# EAGLE design bristol_longshot (EAGLE 7.3.0)
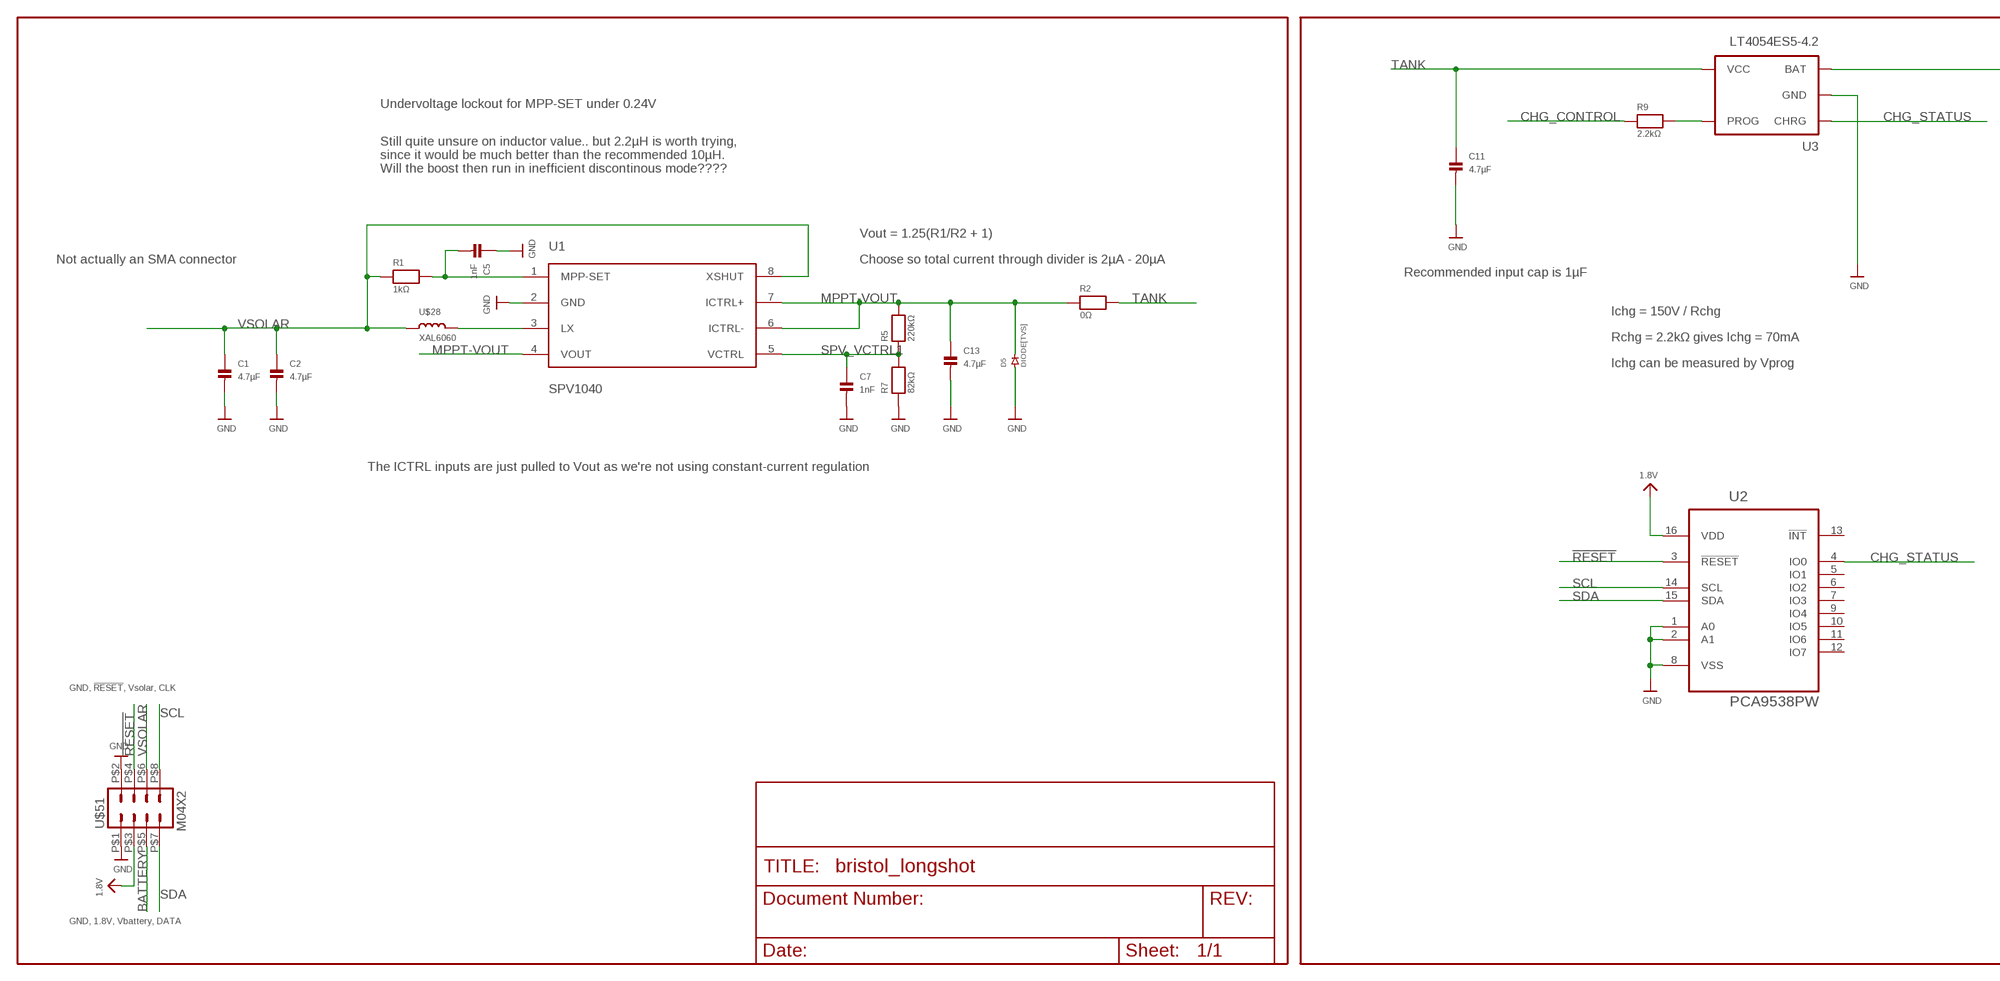
[diagram p0: schematic, sheet 1, part 1 of 2]
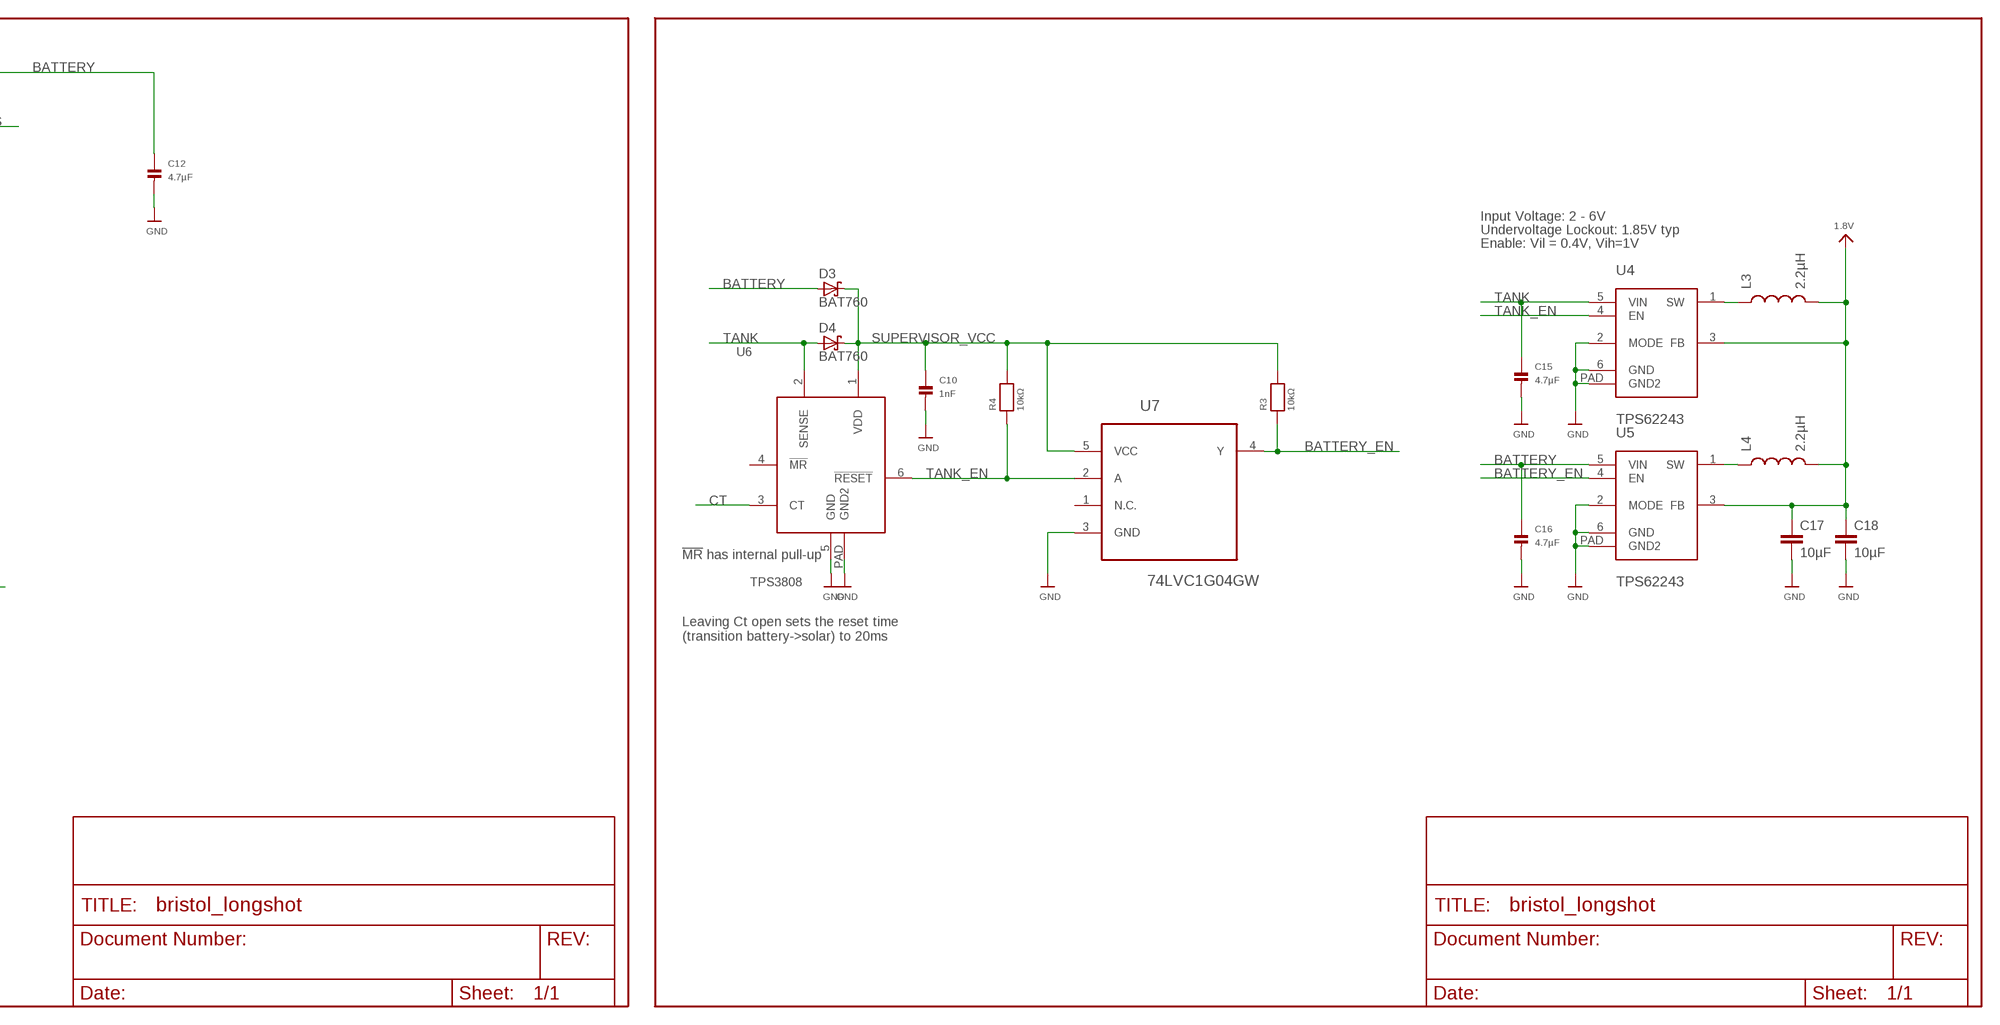
[diagram p1: schematic, sheet 1, part 2 of 2]

## Parts
C1  4.7µF  CAP_CERAMIC_0402  [_0402]
C2  4.7µF  CAP_CERAMIC_0402  [_0402]
C5  1nF  CAP_CERAMIC_0402  [_0402]
C7  1nF  CAP_CERAMIC_0402  [_0402]
C10  1nF  CAP_CERAMIC_0402  [_0402]
C11  4.7µF  CAP_CERAMIC_0402  [_0402]
C12  4.7µF  CAP_CERAMIC_0402  [_0402]
C13  4.7µF  CAP_CERAMIC_0402  [_0402]
C15  4.7µF  CAP_CERAMIC_0402  [_0402]
C16  4.7µF  CAP_CERAMIC_0402  [_0402]
C17  10µF  C-EUC0603K  [C0603K]
C18  10µF  C-EUC0603K  [C0603K]
D3  BAT760  [SOD323]
D4  BAT760  [SOD323]
D5  DIODE[TVS]  [SOD123W]
L3  2.2µH  INDUCTOR1007  [1007]
L4  2.2µH  INDUCTOR1007  [1007]
R1  1kΩ  RESISTOR_0402  [_0402]
R2  0Ω  RESISTOR_0402  [_0402]
R3  10kΩ  RESISTOR_0402  [_0402]
R4  10kΩ  RESISTOR_0402  [_0402]
R5  220kΩ  RESISTOR_0402  [_0402]
R7  82kΩ  RESISTOR_0402  [_0402]
R9  2.2kΩ  RESISTOR_0402  [_0402]
U1  SPV1040  [TSSOP8]
U2  PCA9538PW  [SOP65P640X110-16N]
U3  LT4054ES5-4.2  [SOT23-5]
U4  TPS62243  [S-PWSON-N6]
U5  TPS62243  [S-PWSON-N6]
U6  TPS3808  [S-PWSON-N6]
U7  74LVC1G04GW  [SOT65P210X110-5N]
U$28  XAL6060  [XAL60]
U$51  M04X2  [M04X2]

## Nets
1.8V: C17.1 C18.1 L3.2 L4.2 U2.16(VDD) U4.3(FB) U5.3(FB) U$51.P$3
!RESET: U2.3(!RESET) U$51.P$4
BATTERY: C12.1 C16.1 D3.A U3.3(BAT) U5.5(VIN) U$51.P$5
BATTERY_BUCK_SW: L4.1 U5.1(SW)
BATTERY_EN: R3.1 U5.4(EN) U7.4(Y)
CHG_CONTROL: R9.1
CHG_STATUS: U2.4(IO0) U3.1(CHRG)
CT: U6.3(CT)
GND: C1.2 C2.2 C5.1 C7.2 C10.2 C11.2 C12.2 C13.2 C15.2 C16.2 C17.2 C18.2 D5.P$1 R7.1 U1.2(GND) U2.1(A0) U2.2(A1) U2.8(VSS) U3.2(GND) U4.2(MODE) U4.6(GND) U4.PAD(GND2) U5.2(MODE) U5.6(GND) U5.PAD(GND2) U6.5(GND) U6.PAD(GND2) U7.3(GND) U$51.P$1 U$51.P$2
LX1: U1.3(LX) U$28.P$2
MPP-SET: C5.2 R1.2 U1.1(MPP-SET)
MPPT-VOUT: C13.1 D5.P$2 R2.1 R5.2 U1.4(VOUT) U1.6(ICTRL-) U1.7(ICTRL+)
PROG: R9.2 U3.5(PROG)
SCL: U2.14(SCL) U$51.P$8
SDA: U2.15(SDA) U$51.P$7
SPV_VCTRL1: C7.1 R5.1 R7.2 U1.5(VCTRL)
SUPERVISOR_VCC: C10.1 D3.C D4.C R3.2 R4.2 U6.1(VDD) U7.5(VCC)
TANK: C11.1 C15.1 D4.A R2.2 U3.4(VCC) U4.5(VIN) U6.2(SENSE)
TANK_BUCK_SW: L3.1 U4.1(SW)
TANK_EN: R4.1 U4.4(EN) U6.6(!RESET) U7.2(A)
VSOLAR: C1.1 C2.1 R1.1 U1.8(XSHUT) U$28.P$1 U$51.P$6
Unconnected: U2.5(IO1) U2.6(IO2) U2.7(IO3) U2.9(IO4) U2.10(IO5) U2.11(IO6) U2.12(IO7) U2.13(!INT) U6.4(!MR) U7.1(N.C.)

## Notes on the sheet
- Undervoltage lockout for MPP-SET under 0.24V
- Still quite unsure on inductor value.. but 2.2µH is worth trying,
  since it would be much better than the recommended 10µH.
  Will the boost then run in inefficient discontinous mode????
- Input Voltage: 2 - 6V
- Undervoltage Lockout: 1.85V typ
- Vout = 1.25(R1/R2 + 1) | Enable: Vil = 0.4V, Vih=1V
- Not actually an SMA connector | Choose so total current through divider is 2µA - 20µA
- Recommended input cap is 1µF
- Ichg = 150V / Rchg
- Rchg = 2.2kΩ gives Ichg = 70mA
- Ichg can be measured by Vprog
- The ICTRL inputs are just pulled to Vout as we're not using constant-current regulation
- !MR! has internal pull-up
- Leaving Ct open sets the reset time
  (transition battery->solar) to 20ms
- GND, !RESET!, Vsolar, CLK
- GND, 1.8V, Vbattery, DATA

## Library data of the parts
C1 C2 C5 C7 C10-C13 C15 C16 = microbuilder_v3:CAP_CERAMIC: Ceramic Capacitors 0402 - 0402 Surface Mount Capacitors 16pF 50V 5% [Digikey: 445-4899-2-ND] 18pF 50V 5% [Digikey: 490-1281-2-ND] 22pF 50V 5% [Digikey: 490-1283-2-ND] 68pF 50V 5% [Digikey: 490-1289-2-ND] 0.1uF 10V 10% [Digikey: 490-1318-2-ND] 1.0uF 6.3V 10% [Digikey: 490-1320-2-ND] 0603 - 0603 Surface Mount Capacitors 16 pF 50V 5% [Digikey: 445-5051-2-ND] 22 pF 50V [Digikey: PCC220ACVTR-ND] 33 pF 50V 5% [Digikey: 490-1415-1-ND] 56pF 50V 5% [Digikey: 490-1421-1-ND] 220pF 50V 5% [Digikey: 445-1285-1-ND] 680 pF 50V 2200 pF 50V 5% C0G [Digikey: 445-1297-1-ND] 5600 pF 100V 5% X7R [Digikey: 478-3711-1-ND] 0.1 µF 25V 10% [Digikey: PCC2277TR-ND] 0.22 µF 16V 10% X7R [Digikey: 445-1318-1-ND] 1.0 µF 25V 10% [Digikey: 445-5146-2-ND] 0603 - RF Specific 3pF 250V +/-0.1pF RF [Digikey: 712-1347-1-ND] 18 pF 250V 5% [Digikey: 478-3505-1-ND or 712-1322-1-ND] 56 pF 250V 5% C0G RF [Digikey: 490-4867-1-ND] 68 pF 250V RF [Digikey: 490-4868-1-ND] 0805 - 0805 Surface Mount Capacitors 220 pF 250V 2% RF Ceramic Capacitor [Digikey: 712-1398-1-ND] 1000 pF 50V 2% NP0 Ceramic Capacitor [Digikey: 478-3760-1-ND] 0.1 µF 25V 10% Ceramic Capacitor [Digikey: PCC1828TR-ND] 1.0 µF 16V 10% Ceramic Capacitor[Digikey: 490-1691-2-ND] 10.0 µF 10V 10% Ceramic Capacitor[Digikey: 709-1228-1-ND] 10.0 uF 16V 10% Ceramic Capacitor [Digikey: 478-5165-2-ND] 47 uF 6.3V 20% Ceramic Capacitor [Digikey: 587-1779-1-ND or 399-5506-1-ND] 1206 - 1206 Surface Mount Capacitors 47uF 10V 20% Ceramic Capacitor [Digikey: 490-5528-1-ND or 399-5508-1-ND or 445-6010-1-ND] 100uF 6.3V -20%, +80% Y5V Ceramic Capacitor (Digikey: 490-4512-1-ND, Mouser: 81-GRM31CF50J107ZE1L)
C17 C18 = resistor:C-EU: CAPACITOR, European symbol
D3 D4 = BAT760:BAT760
D5 = nxp:DIODE[TVS]
L3 L4 = SparkFun:INDUCTOR: Inductors Basic Inductor/Choke - 0603 and 1206. Footprints are not proven and vary greatly between part numbers.
R1-R5 R7 R9 = microbuilder_v3:RESISTOR: Resistors 0402 - 0402 Surface Mount Package 22 Ohm 1% 1/16W [Digikey: 311-22.0LRTR-ND] 33 Ohm 5% 1/16W 1.0K 5% 1/16W 1.5K 5% 1/16W 2.0K 1% 1/16W 10.0K 1% 1/16W [Digikey: 311-10.0KLRTR-ND] 10.0K 5% 1/16W [Digikey: RMCF0402JT10K0TR-ND] 12.1K 1% 1/16W [Digikey: 311-22.0LRTR-ND] 100.0K 5% 1/16W 0603 - 0603 Surface Mount Package 0 Ohm 1/10 Watt 1% Resistor 15 Ohm 1/10 Watt 1% Resistor 33 Ohm 1/10 Watt 1% Resistor 49.9 Ohm 1/10 Watt 1% Resistor 100 Ohm 1/10 Watt 1% Resistor 150 Ohm 1/10 Watt 1% Resistor 240 Ohm 1/10 Watt 1% Resistor 390 Ohm 1/10 Watt 1% Resistor 560 Ohm 1/10 Watt 1% Resistor 680 Ohm 1/10 Watt 1% Resistor 750 Ohm 1/10 Watt 1% Resistor 1.0K Ohm 1/10 Watt 1% Resistor 1.5K Ohm 1/10 Watt 1% Resistor 2.0K Ohm 1/10 Watt 1% Resistor 2.2K Ohm 1/10 Watt 1% Resistor 3.3K Ohm 1/10 Watt 1% Resistor 4.7K Ohm 1/10 Watt 1% Resistor 10.0K Ohm 1/10 Watt 1% Resistor 12.0K Ohm 1/10 Watt 1% Resistor 12.1K Ohm 1/10 Watt 1% Resistor 20.0K Ohm 1/10 Watt 1% Resistor 33.0K Ohm 1/10 Watt 1% Resistor 100.0K Ohm 1/10 Watt 1% Resistor 0805 - 0805 Surface Mount Package 0 Ohm 1/8 Watt 1% Resistor 33 Ohm 1/8 Watt 1% Resistor 100 Ohm 1/8 Watt 1% Resistor 150 Ohm 1/8 Watt 1% Resistor 200 Ohm 1/8 Watt 1% Resistor 240 Ohm 1/8 Watt 1% Resistor 330 Ohm 1/8 Watt 1% Resistor 390 Ohm 1/8 Watt 1% Resistor 470 Ohm 1/8 Watt 1% Resistor 1.0K Ohm 1/8 Watt 1% Resistor 1.5K Ohm 1/8 Watt 1% Resistor 2.0K Ohm 1/8 Watt 1% Resistor 4.7K Ohm 1/8 Watt 1% Resistor 5.1K Ohm 1/8 Watt 1% Resistor 5.6K Ohm 1/8 Watt 1% Resistor 10.0K Ohm 1/8 Watt 1% Resistor 22.0K Ohm 1/8 Watt 1% Resistor 33.0K Ohm 1/8 Watt 1% Resistor 100K Ohm 1/8 Watt 1% Resistor 1206 - 1206 Surface Mount Package 2012 - 2010 Surface Mount Package 0.11 Ohm 1/2 Watt 1% Resistor - Digikey: RHM.11UCT-ND
U1 = spv1040:SPV1040
U2 = PCA9538PW:PCA9538PW: IC, IO PORT, I2C/SMBUS 8BIT, 16TSSOP; MPN: PCA9538PW; OC_FARNELL: 2212095; OC_NEWARK: 55W4315; PACKAGE: TSSOP16; SUPPLIER: NXP
U3 = XYKlib:LT4054: Standalone Linear Li-Ion Battery Charger A complete constant-current/constant voltage linear charger for single cell lithium-ion batteries.in SOT-23-5 package.
U4 U5 = TPS62243:TPS62243
U6 = TPS3808:TPS3808
U7 = 74LVC1G04GW_inverter:74LVC1G04GW: Single inverter; MPN: 74LVC1G04GW; OC_FARNELL: 1631683; OC_NEWARK: 03P2774; PACKAGE: SOT-5; SUPPLIER: NXP
U$28 = XAL6060:XAL6060
U$51 = fbri:M04X2

## Board
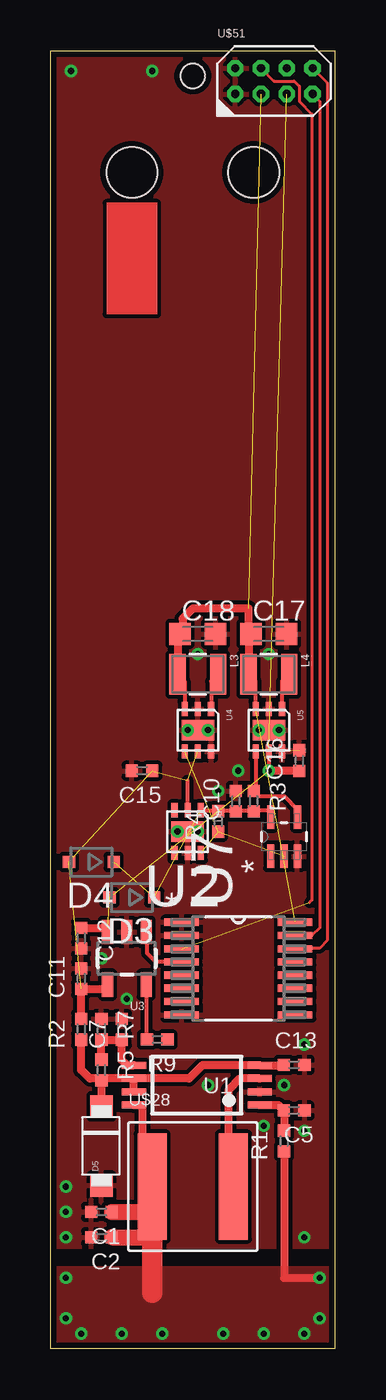
[diagram p2: board, top side]
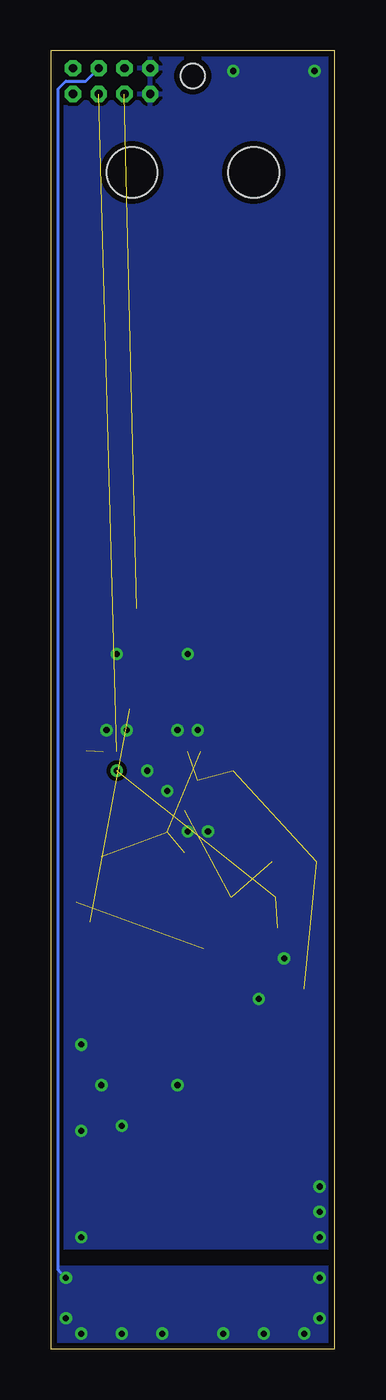
[diagram p3: board, bottom side, seen from below]

Size 14 x 64 mm. Coordinates in mm from the lower left corner, seen from the top.
Outline: 0,0 0,64 14,64 14,0 0,0
Copper layers (1*16): Top 0.035mm / dielectric 1.5mm / Bottom 0.035mm
Design rules "PCB-POOL Standard *": minimum track width 0.15mm, minimum drill 0.3mm, track to track 0.15mm, track to pad 0.15mm, pad to pad 0.15mm, via to via 0.15mm, smd to smd 0.15mm, copper to edge 0.3mm, drill to drill 0.2mm, minimum pad ring 0.2mm, minimum via ring 0.15mm, stop-mask expansion 0.075mm, vias tented up to drill 0.3mm, thermal gap 0.2mm
Holes 1.2 mm at 7,62.75
Holes 2.5 mm at 4,58 10,58

### Footprints (pad centres in the part's own frame; a part is rotated, then mirrored left to right if it is on the bottom)
_0402 = smd 0.6 x 0.6: 1 -0.508,0; 2 0.508,0
C0603K = smd 1.05 x 1.08: 1 -0.875,0; 2 0.875,0
SOD323 = smd 0.6 x 0.6: A 1.1,0; C -1.1,0
SOD123W = smd 1.1 x 1.1: P$1 -1.95,0; P$2 1.95,0
1007 = smd 2 x 0.8: 1 0,1; 2 0,-1
TSSOP8 = smd 1.2 x 0.35: 1 -0.8,0.475; 2 -0.8,-0.175; 3 -0.8,-0.825; 4 -0.8,-1.475; 5 5.4,-1.475; 6 5.4,-0.825; 7 5.4,-0.175; 8 5.4,0.475
SOP65P640X110-16N = smd 1.702 x 0.356: 1 -2.794,2.286; 2 -2.794,1.626; 3 -2.794,0.965; 4 -2.794,0.33; 5 -2.794,-0.33; 6 -2.794,-0.965; 7 -2.794,-1.626; 8 -2.794,-2.286; 9 2.794,-2.286; 10 2.794,-1.626; 11 2.794,-0.965; 12 2.794,-0.33; 13 2.794,0.33; 14 2.794,0.965; 15 2.794,1.626; 16 2.794,2.286
SOT23-5 = smd 0.55 x 1.2: 1 -0.95,-1.3; 2 0,-1.3; 3 0.95,-1.3; 4 0.95,1.3; 5 -0.95,1.3
S-PWSON-N6 = smd 0.3 x 0.7: 1 -0.65,-1.05; 2 0,-1.05; 3 0.65,-1.05; 4 0.65,1.05; 5 0,1.05; 6 -0.65,1.05 | smd 1.6 x 1: PAD 0,0
SOT65P210X110-5N = smd 1.168 x 0.356: 1 -0.965,0.66; 2 -0.965,0; 3 -0.965,-0.66; 4 0.965,-0.66; 5 0.965,0.66
XAL60 = smd 1.43 x 5.24: P$1 -2,0; P$2 2,0
M04X2 = drill 0.4 octagon: P$1 -1.905,-0.635; P$2 -1.905,0.635; P$3 -0.635,-0.635; P$4 -0.635,0.635; P$5 0.635,-0.635; P$6 0.635,0.635; P$7 1.905,-0.635; P$8 1.905,0.635

### Placement (x,y rotation side)
C1  2.5,6.75 180 top
C2  2.5,5.5 180 top
C5  12,11.75 180 top
C7  3.5,15.75 90 top
C10  9.12,27 90 top
C11  1.5,18.25 90 top
C12  1.5,20.25 270 top
C13  12,14 0 top
C15  4.5,28.5 180 top
C16  12.25,29 90 top
C17  10.75,35.25 0 top
C18  7.25,35.25 0 top
D3  4,22.25 180 top
D4  2,24 180 top
D5  2.5,10 90 top
L3  7.25,33.25 270 top
L4  10.75,33.25 270 top
R1  11.5,10.25 90 top
R2  1.5,15.75 90 top
R3  10,27 270 top
R4  8.25,26 90 top
R5  2.5,13.75 270 top
R7  2.5,15.75 270 top
R9  5.25,15.25 180 top
U1  9.5,12.5 180 top
U2  9.25,18.75 0 top
U3  3.75,19.25 180 top
U4  7.25,30.5 180 top
U5  10.75,30.5 180 top
U6  6.75,25.5 180 top
U7  11.5,25.25 90 top
U$28  7,8 0 top
U$51  11,62.5 0 top

### Tracks (layer width: path | path; a pad name or v marks a point on that pad's centre or on a via)
1.8V  (2 unrouted)
  Top 0.2: L3.2 6.6,32.9 U4.3 | U5.3 10.1,32.9 L4.2
  Top 0.4: L3.2 6.25,35.12 C18.1 6.5,35.38 6.5,36 7,36.5 9.75,36.5 9.75,35.38 C17.1 9.75,35.12 L4.2
!RESET  (1 unrouted)
  Top 0.15: U$51.P$4 11,62.5 12,62.5 12.25,62.25 12.25,61.5 12.88,60.88 12.88,22.12 12.75,22
BATTERY  (via drill 0.3)  (3 unrouted)
  Top 0.2: U5.5 v10.75,28.5
  Top 0.4: C12.1 2.75,20.76 | 2.75,20.76 2.75,20.5 | 2.75,20.76 2.8,20.76 U3.3 | C16.1 v10.76,28.49 v10.75,28.5
BATTERY_BUCK_SW
  Top 0.2: U5.1 11.4,32.9 L4.1
BATTERY_EN
  Top 0.2: U5.4 10.1,27.61 R3.1 10.26,27.25 11.5,27.25 12.16,26.59 U7.4
CHG_STATUS
  Top 0.2: U2.4 5.17,19.08 4.75,19.5 4.75,20.5 U3.1
GND  (via drill 0.3)  (1 unrouted)
  other vias: 1,63 5,63 0.75,8 0.75,6.75 0.75,5.5 11.5,13 10.5,11 7.75,13 12.5,5.5 12.5,10.75 12.5,15 2.5,19.25 3.75,17.25 9.25,28.5 8.25,27.5 7.25,34.25 10.75,34.25 6.25,25.5 7.25,25.5 6.75,30.5 7.75,30.5 10.25,30.5 11.25,30.5
  pour Top (isolate 0.2): 0,64 14,64 14,5 0,5
  pour Bottom (isolate 0.2): 0,64 14,64 14,5 0,5
LX1
  Top 0.4: U1.3 9.32,13.32 8.75,12.75 8.75,8.25 U$28.P$2
MPP-SET
  Top 0.4: R1.2 C5.2 11.22,12.03 U1.1
MPPT-VOUT
  Top 0.4: U1.7 U1.6 | U1.6 6.83,13.32 7.47,13.97 U1.4 11.47,13.97 C13.1 | U1.6 2.58,13.32 | 2.58,13.32 R5.2 D5.P$2 | 2.58,13.32 1.93,13.32 1.5,13.75 R2.1
PROG
  Top 0.2: U3.5 4.7,15.29 R9.2
SCL
  Top 0.15: U$51.P$8 13.62,62.41 13.62,20.12 13.25,19.75 12.08,19.75 U2.14
SDA
  Top 0.15: U$51.P$7 13.25,61.52 13.25,20.75 12.88,20.38 U2.15
SPV_VCTRL1
  Top 0.4: R5.1 R7.2 C7.1 3.5,14.22 3.75,14 3.77,13.97 U1.5
SUPERVISOR_VCC  (2 unrouted)
  Top 0.2: 9,26.55 10.06,26.55 | U7.5 10.76,26.55 10.06,26.55 | 10.06,26.55 R3.2 | U6.1 8.5,26.55 | 8.5,26.55 9,26.55 | R4.2 8.46,26.51 8.5,26.55 | C10.1 9.06,26.49 9,26.55
TANK  (4 unrouted)
  Top 0.2: U6.2 6.75,28.01
  Top 0.4: R2.2 C11.1 2.59,17.74 U3.4
TANK_BUCK_SW
  Top 0.2: L3.1 7.9,32.9 U4.1
TANK_EN  (3 unrouted)
VSOLAR  (via drill 0.3)
  Top 0.4: U1.8 4.5,12.03 4.5,10 5,10 U$28.P$1 | R1.1 11.5,3.5 v13.25,3.5
  Top 0.8: C2.1 5,5.5 | C1.1 5,6.75
  Top 1: U$28.P$1 5,6.75 5,5.5 5,2.75
  Bottom 0.15: U$51.P$6 12.27,62.5 13.25,62.5 13.62,62.12 13.62,3.88 v13.25,3.5
  other vias: 0.75,3.5 0.75,1.5 1.5,0.75 3.5,0.75 5.5,0.75 8.5,0.75 10.5,0.75 12.5,0.75 13.25,1.5
  pour Bottom: 0,4 14,4 14,0 0,0
  pour Top: 0,4 14,4 14,0 0,0
(copper drawn outside any net)
  shapes: Top area x1

### Text on the board
tStop: UNIVERSITY | OF | BRISTOL | +ve | -ve